# EAGLE design main (EAGLE 6.6.0)
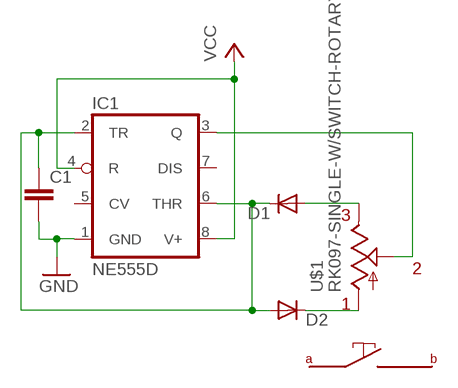
[diagram p0: schematic, sheet 1]

## Parts
C1  C-EUC0603  [C0603]
D1  DIODE-MICROMELF-W  [MICROMELF-W]
D2  DIODE-MICROMELF-W  [MICROMELF-W]
IC1  NE555D  [SO08]
U$1  RK097-SINGLE-W/SWITCH-ROTARY  [RK097-DUAL-ELEMENT-W/SWITCH]

## Nets
GND: C1.2 IC1.1(GND)
N$1: IC1.3(Q) U$1.P$5(S) U$1.P$6(S1)
N$2: D2.C U$1.P$1(A) U$1.P$2(A1)
N$3: D1.A U$1.P$3(E) U$1.P$4(E1)
N$4: C1.1 D1.C D2.A IC1.2(TR) IC1.6(THR)
VCC: IC1.4(R) IC1.8(V+)
Unconnected: IC1.5(CV) IC1.7(DIS)

## Library data of the parts
C1 = rcl:C-EU: CAPACITOR, European symbol
D1 D2 = diode:DIODE-: DIODE
IC1 = linear:*555: TIMER
U$1 = alps_japan_potentiometers:RK097-SINGLE-W/SWITCH-ROTARY: Shematic Single Element w/ Switch

## Board
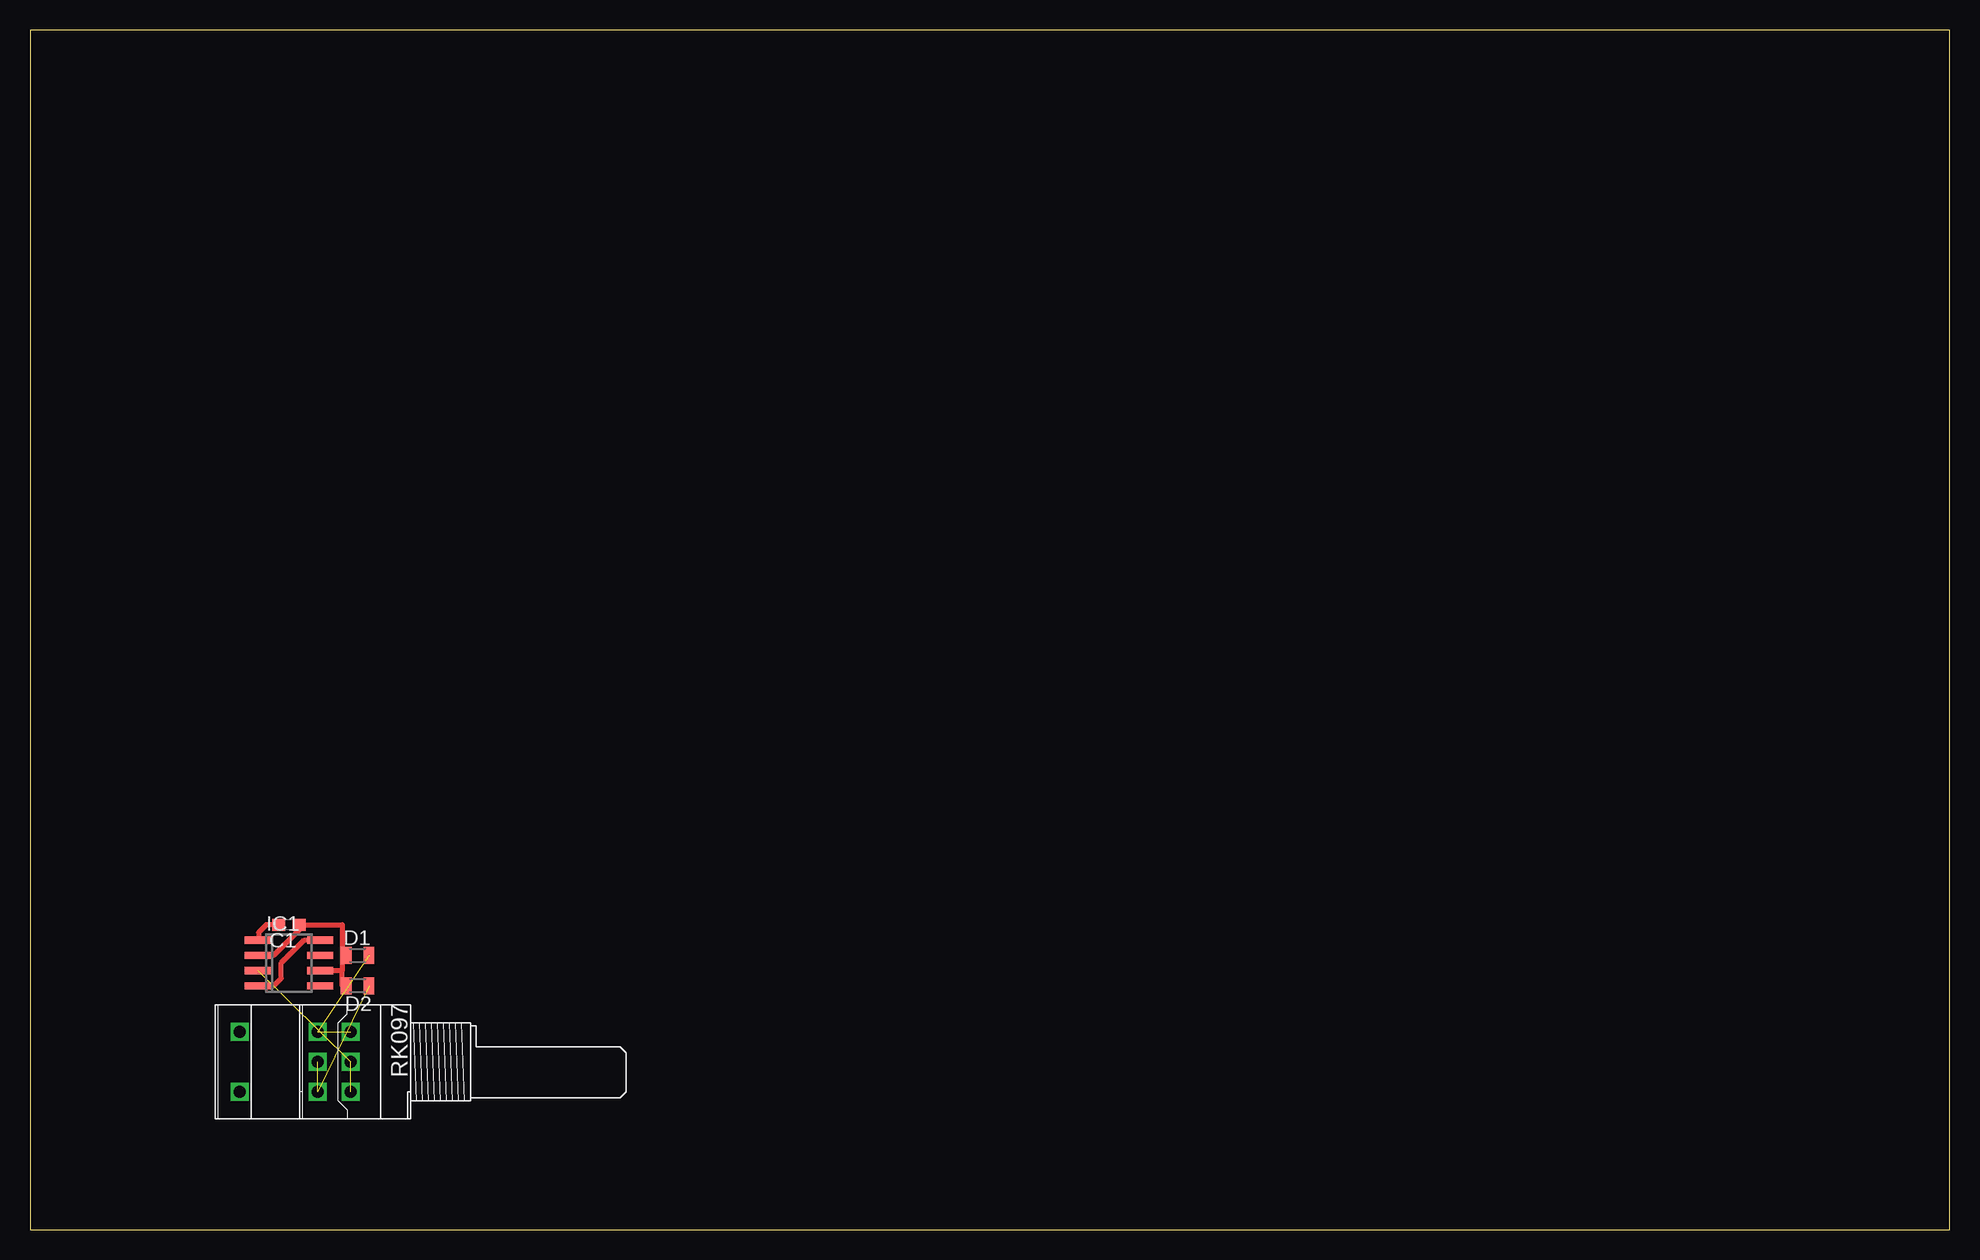
[diagram p1: board, top side]

Size 160 x 100 mm. Coordinates in mm from the lower left corner, seen from the top.
Outline: 0,0 160,0 160,100 0,100 0,0
Copper layers (1*16): Top 0.035mm / dielectric 1.5mm / Bottom 0.035mm
Design rules "default": minimum track width 10mil, minimum drill 24mil, track to track 8mil, track to pad 8mil, pad to pad 8mil, via to via 8mil, smd to smd 8mil, copper to edge 40mil, drill to drill 8mil, minimum pad ring 10mil, minimum via ring 8mil, stop-mask expansion 4mil, vias tented up to drill 0mil, thermal gap 10mil

### Footprints (pad centres in the part's own frame; a part is rotated, then mirrored left to right if it is on the bottom)
C0603 = smd 1.1 x 1: 1 -0.85,0; 2 0.85,0
MICROMELF-W = smd 0.9 x 1.4: A 0.95,0; C -0.95,0
SO08 = smd 0.6 x 2.2: 1 -1.905,-2.6; 2 -0.635,-2.6; 3 0.635,-2.6; 4 1.905,-2.6; 5 1.905,2.6; 6 0.635,2.6; 7 -0.635,2.6; 8 -1.905,2.6
RK097-DUAL-ELEMENT-W/SWITCH = drill 1 pad 1.422 square: P$1 -2.5,2.69; P$2 0,2.69; P$3 2.5,2.69; P$4 2.5,-0.06; P$5 0,-0.06; P$6 -2.5,-0.06; P$7 -2.5,9.19; P$8 2.5,9.19

### Placement (x,y rotation side)
C1  21.59,25.4 180 top
D1  27.3,22.86 0 top
D2  27.3,20.32 180 top
IC1  21.59,22.23 270 top
U$1  26.67,13.97 90 top

### Tracks (layer width: path | path; a pad name or v marks a point on that pad's centre or on a via)
GND
  Top 0.406: C1.2 19.68,25.4 19.05,24.77 19.05,24.19 IC1.1
N$1  (2 unrouted)
N$2  (2 unrouted)
N$3  (2 unrouted)
N$4
  Top 0.406: C1.1 22.44,24.98 | 22.44,24.98 20.32,22.86 IC1.2 | IC1.6 26.04,21.59 | 26.04,22.86 26.04,21.59 | D2.A 26.04,20.32 26.04,21.59 | 22.44,24.98 22.23,24.98 22.23,25.4 26.04,25.4 26.04,22.86 | 26.04,22.86 D1.C
VCC
  Top 0.406: IC1.4 20.32,20.32 20.95,20.95 20.95,22.23 22.86,24.13 IC1.8